# EAGLE design Imu shield v1 (EAGLE 6.1)
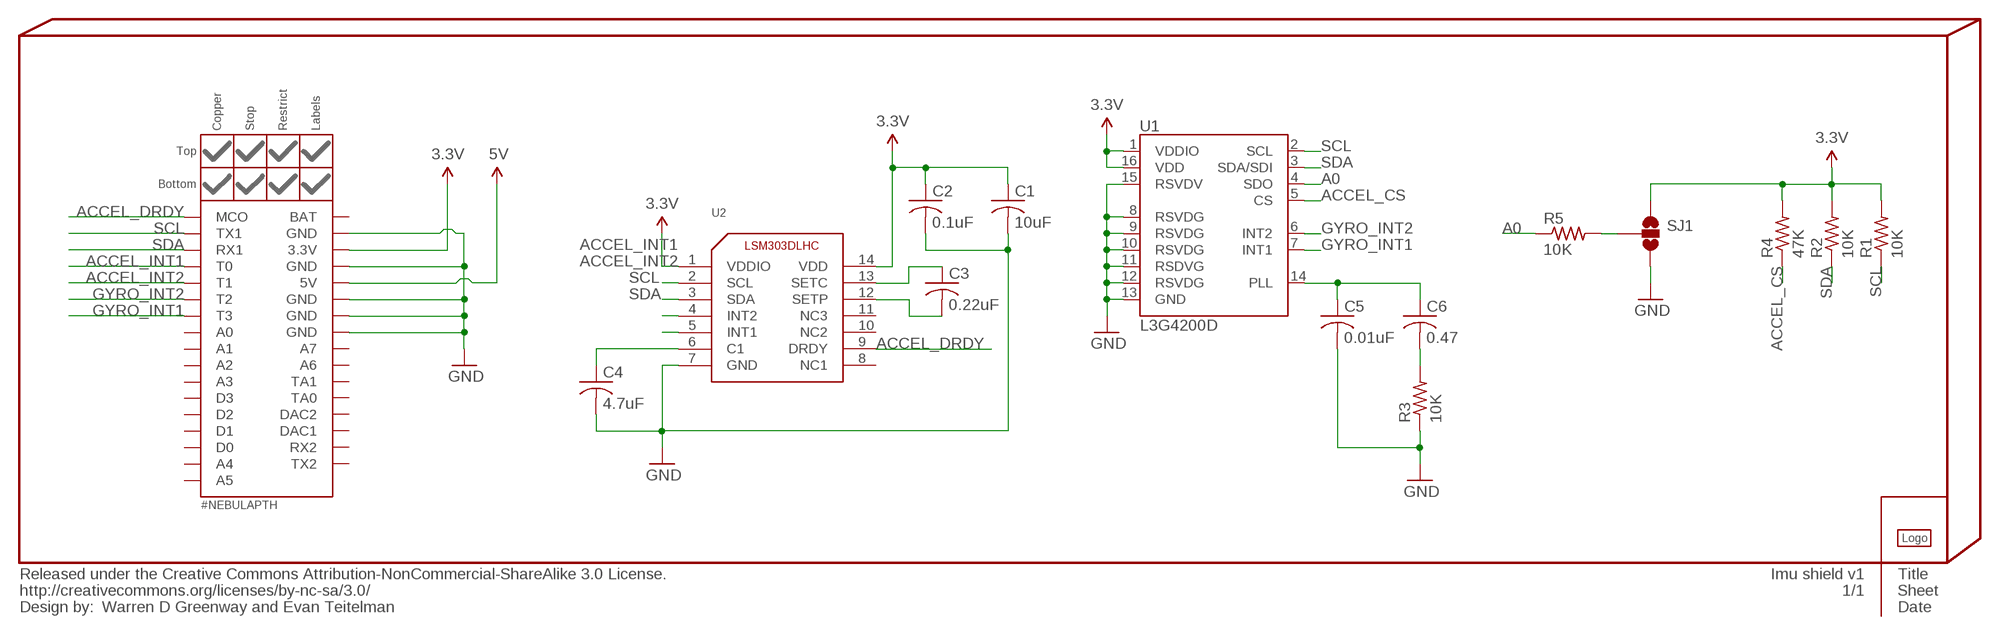
[diagram p0: schematic, sheet 1]

## Parts
C1  10uF  C-USC0805  [C0805]
C2  0.1uF  C-USC0402  [C0402]
C3  0.22uF  C-USC0402  [C0402]
C4  4.7uF  C-USC0402  [C0402]
C5  0.01uF  C-USC0402  [C0402]
C6  0.47  C-USC0402  [C0402]
INFO2  Warren D Greenway and Evan Teitelman  %CC-NC-SA  [%CC-NC-SA]
LOGO1  #PYGMYLOGONORMAL  #PYGMYLOGOLARGE  [#PYGMYLOGO]
NEBULA1  #NEBULAPTH  [#NEBULA-PTH]
NEBULAPART1  #NEBULA-PARTLABELS-TOP  [#NEBULA-LABELS-TOP]
R1  10K  R-US_R0402  [R0402]
R2  10K  R-US_R0402  [R0402]
R3  10K  R-US_R0402  [R0402]
R4  47K  R-US_R0402  [R0402]
R5  10K  R-US_R0402  [R0402]
SJ1  SOLDERJUMPER_2WAYPASTE1&2  [SJ_3_PASTE1&2]
U1  L3G4200D  [LGA16-4X4]
U2  FREESCALE-LSM303DLHC  [LGA14]

## Nets
3.3V: C1.1 C2.1 NEBULA1.3.3V R1.2 R2.2 R4.2 SJ1.1 U1.1(VDDIO) U1.16(VDD) U2.1(VDDIO) U2.14(VDD) ; supply symbol labelled @3.3V
5V: NEBULA1.5V ; supply symbol labelled @5V
A0: R5.1 U1.4(SDO)
ACCEL_CS: R4.1 U1.5(CS)
ACCEL_DRDY: NEBULA1.MCO U2.9(DRDY)
ACCEL_INT1: NEBULA1.T0 U2.4(INT2)
ACCEL_INT2: NEBULA1.T1 U2.5(INT1)
GND: C1.2 C2.2 C4.2 C5.2 NEBULA1.GND1(GND) NEBULA1.GND2(GND) NEBULA1.GND3(GND) NEBULA1.GND4(GND) NEBULA1.GND5(GND) R3.1 SJ1.3 U1.8(RSVDG) U1.9(RSVDG) U1.10(RSVDG) U1.11(RSDVG) U1.12(RSVDG) U1.13(GND) U1.15(RSVDV) U2.7(GND) ; supply symbol labelled @GND
GYRO_INT1: NEBULA1.T3 U1.7(INT1)
GYRO_INT2: NEBULA1.T2 U1.6(INT2)
N$1: C4.1 U2.6(C1)
N$2: C5.1 C6.1 U1.14(PLL)
N$3: C3.1 U2.13(SETC)
N$4: C3.2 U2.12(SETP)
N$5: R5.2 SJ1.2
N$8: C6.2 R3.2
SCL: NEBULA1.COM1_TX(TX1) R1.1 U1.2(SCL) U2.2(SCL)
SDA: NEBULA1.COM1_RX(RX1) R2.1 U1.3(SDA/SDI) U2.3(SDA)
Unconnected: NEBULA1.A0 NEBULA1.A1 NEBULA1.A2 NEBULA1.A3 NEBULA1.A4 NEBULA1.A5 NEBULA1.A6 NEBULA1.A7 NEBULA1.BAT NEBULA1.COM2_RX(RX2) NEBULA1.COM2_TX(TX2) NEBULA1.D0 NEBULA1.D1 NEBULA1.D2 NEBULA1.D3 NEBULA1.DAC1 NEBULA1.DAC2 NEBULA1.TA0 NEBULA1.TA1 U2.8(NC1) U2.10(NC2) U2.11(NC3)

## Library data of the parts
C1-C6 = rcl:C-US: CAPACITOR, American symbol
INFO2 = PygmyBoards:%CC-NC-SA: Released under the Creative Commons Attribution-NonCommercial-ShareAlike 3.0 License. http://creativecommons.org/licenses/by-sa/3.0 Design by: [Designer Name] Change this part's value to change the designer name
LOGO1 = Pygmy:#PYGMYLOGO
NEBULA1 = PygmyBoards:#NEBULA: Nebula Board and Shield Footprint Pads This is the only absolutely required part for the footprint. The parts in "#NEBULA-PART" are merely aesthetic. A circular board outline should be .001" thick and 1.005" in diameter (Reference circle on the Document (48) layer provided).
NEBULAPART1 = PygmyBoards:#NEBULA-PART: Nebula Board and Shield Footprint Parts These parts are only functional when combined with the pads in "#NEBULA".
R1-R5 = rcl:R-US_: RESISTOR, American symbol
SJ1 = Pygmy:SOLDERJUMPER_2WAY: Solder Jumper 2 way solder jumper
U1 = SparkFun:L3G4200D: L3G4200D Three-axis, digital output gyroscope The L3G4200D is a low-power three-axis angular rate sensor, has a full scale of ±250/±500/±2000 dps and is capable of measuring rates with a user-selectable bandwidth. It includes a sensing element and an IC interface capable of providing the measured angular rate to the external world through a digital interface (I2C/SPI). Package: 4x4x1.1 LGA-16 (LGA16-4x4.PAC)
U2 = Pygmy:FREESCALE-LSM303DLHC

## Board
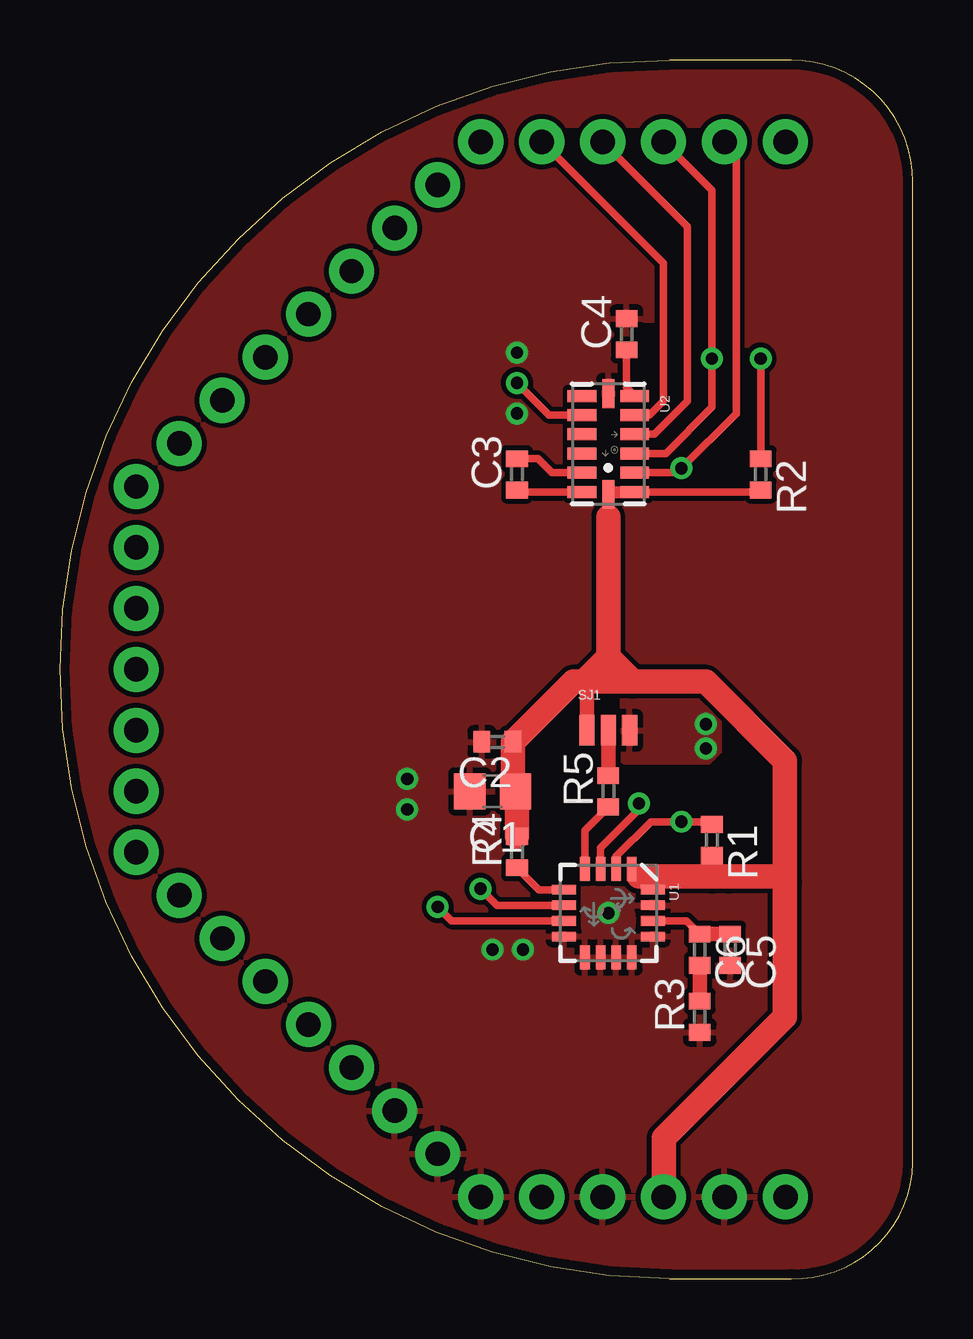
[diagram p1: board, top side]
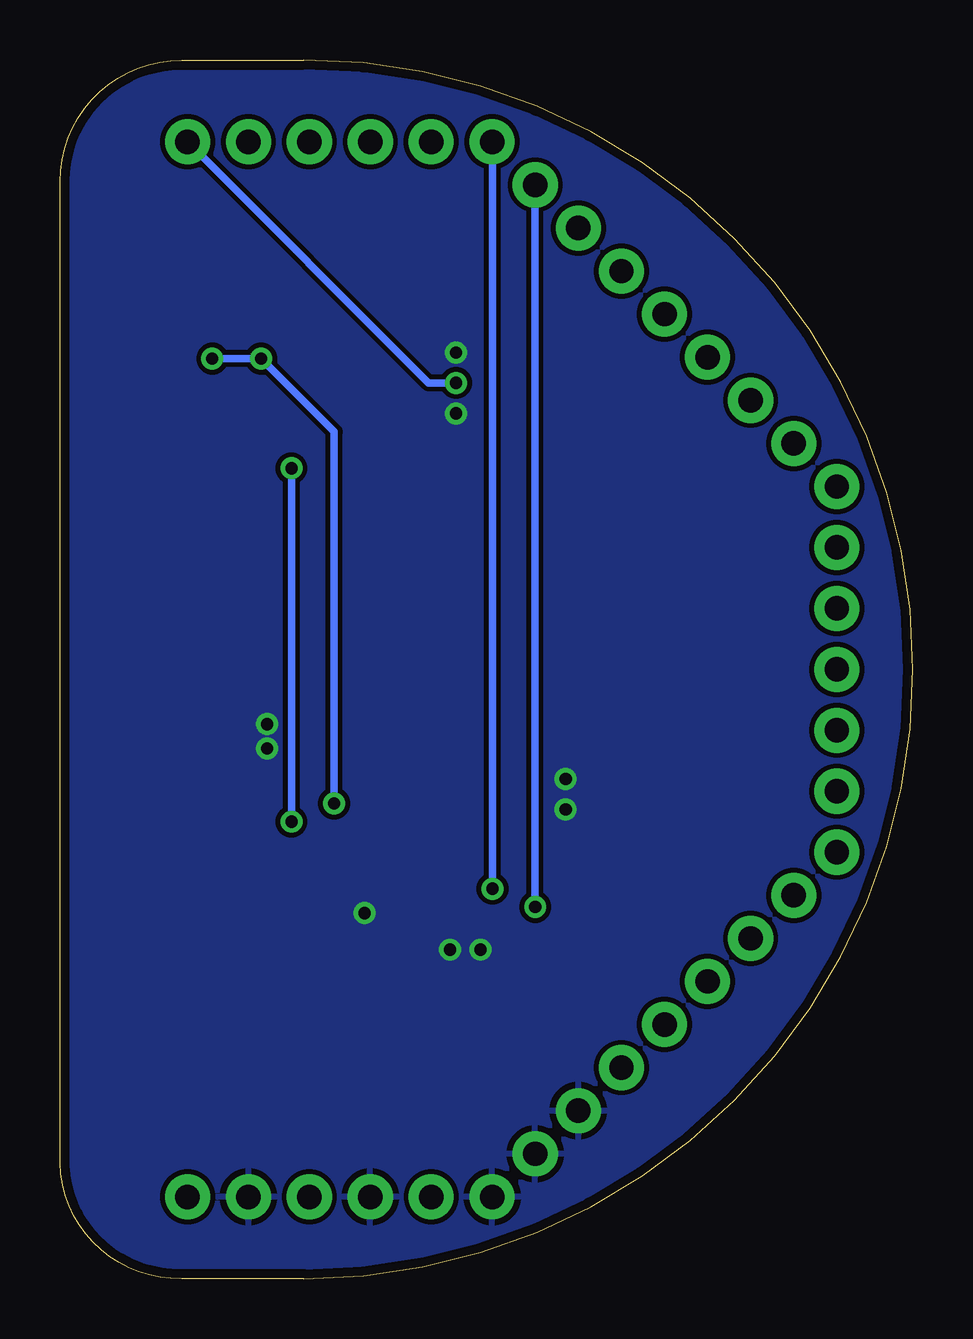
[diagram p2: board, bottom side, seen from below]

Size 35.56 x 50.8 mm. Coordinates in mm from the lower left corner, seen from the top.
Outline: 25.4,0 arc-180 25.4,50.8 30.48,50.8 arc-90 35.56,45.72 35.56,4.83 arc-90 30.48,0 25.4,0
Copper layers (1*16): Top 0.035mm / dielectric 1.5mm / Bottom 0.035mm
Design rules "PDX (Production)": minimum track width 6mil, minimum drill 15mil, track to track 6mil, track to pad 6mil, pad to pad 4mil, via to via 6mil, smd to smd 4mil, copper to edge 15mil, drill to drill 6mil, minimum pad ring 10mil, minimum via ring 8mil, stop-mask expansion 4mil, vias tented up to drill 25mil, thermal gap 10mil
tRestrict: 9 lines

### Footprints (pad centres in the part's own frame; a part is rotated, then mirrored left to right if it is on the bottom)
C0805 = smd 1.3 x 1.5: 1 -0.95,0; 2 0.95,0
C0402 = smd 0.7 x 0.9: 1 -0.65,0; 2 0.65,0
#NEBULA-PTH@1 = drill 1.016 pad 1.88 round: 3.3V -25.637,-47.388; 5V -30.716,-47.388; A0 -36.848,-7.004; A1 -38.645,-8.8; A2 -40.44,-10.596; A3 -42.237,-12.392; A4 -47.625,-22.86; A5 -47.625,-25.4; A6 -40.44,-40.204; A7 -38.645,-42; BAT -20.557,-47.388; COM1_RX -25.636,-3.412; COM1_TX -23.096,-3.412; COM2_RX -47.625,-30.48; COM2_TX -47.625,-27.94; D0 -47.625,-20.32; D1 -47.625,-17.78; D2 -45.829,-15.984; D3 -44.032,-14.188; DAC1 -47.625,-33.02; DAC2 -45.829,-34.816; GND1 -36.848,-43.796; GND2 -35.052,-45.592; GND3 -33.256,-47.388; GND4 -28.177,-47.388; GND5 -23.097,-47.388; MCO -20.556,-3.412; T0 -28.176,-3.412; T1 -30.716,-3.412; T2 -33.256,-3.412; T3 -35.052,-5.208; TA0 -44.032,-36.612; TA1 -42.237,-38.408
R0402 = smd 0.7 x 0.9: 1 -0.65,0; 2 0.65,0
SJ_3_PASTE1&2 = smd 0.635 x 1.27: 1 -0.889,0; 2 0,0; 3 0.889,0
LGA16-4X4 = smd 1 x 0.4: 1 -1.85,0.975; 2 -1.85,0.325; 3 -1.85,-0.325; 4 -1.85,-0.975; 9 1.85,-0.975; 10 1.85,-0.325; 11 1.85,0.325; 12 1.85,0.975 | smd 0.4 x 1: 5 -0.975,-1.85; 6 -0.325,-1.85; 7 0.325,-1.85; 8 0.975,-1.85; 13 0.975,1.85; 14 0.325,1.85; 15 -0.325,1.85; 16 -0.975,1.85
LGA14 = smd 0.5 x 1.2: 1 2,1.1; 2 1.2,1.1; 3 0.4,1.1; 4 -0.4,1.1; 5 -1.2,1.1; 6 -2,1.1; 8 -2,-1.1; 9 -1.2,-1.1; 10 -0.4,-1.1; 11 0.4,-1.1; 12 1.2,-1.1; 13 2,-1.1 | smd 1.2 x 0.5: 7 -2.1,0; 14 2.1,0

### Placement (x,y rotation side)
C1  18.03,20.32 180 top
C2  18.24,22.38 180 top
C3  19.05,33.53 90 top
C4  23.62,39.37 90 top
C5  27.94,13.72 270 top
C6  26.67,13.72 270 top
INFO2  -2.54,-10.16 0 top  (outside the outline)
LOGO1  27.94,9.91 90 bottom
NEBULA1  #NEBULAPTH  [#NEBULA-PTH@1]  50.8,50.8 0 top
NEBULAPART1  50.8,50.8 0 top  (outside the outline)
R1  27.18,18.29 270 top
R2  29.21,33.53 270 top
R3  26.67,10.92 90 top
R4  19.05,17.78 90 top
R5  22.86,20.32 90 top
SJ1  22.86,22.86 0 top
U1  22.86,15.24 270 top
U2  22.86,34.8 270 top

### Tracks (layer width: path | path; a pad name or v marks a point on that pad's centre or on a via)
3.3V
  Top 0.254: U1.1 27.36,17.09 27.94,16.51 27.96,16.51 28.22,16.76 27.89,16.76
  Top 0.305: U1.16 24.71,16.69 24.64,16.76 | 24.13,16.76 24.13,16.8 U1.1 | U2.1 29.13,32.8 R2.2
  Top 0.508: 22.86,31.75 U2.14 22.96,32.8 U2.1
  Top 0.61: SJ1.1 21.97,24.77 22.1,24.89 | 27.18,16.76 R1.2
  Top 1.016: 24.13,16.76 24.64,16.76 27.18,16.76 27.89,16.76 29.97,16.76 30.23,16.51 | R4.2 19.05,20.25 C1.1 18.89,20.42 C2.1 21.4,24.89 21.84,24.89 | 23.88,24.89 26.92,24.89 30.23,21.59 30.23,16.51 | 23.88,24.89 22.86,24.89 | 22.86,24.89 22.1,24.89 21.84,24.89 | 22.86,24.89 22.86,25.91 | 22.86,25.91 22.86,31.75 | 22.86,25.91 21.84,24.89 | 23.88,24.89 22.86,25.91 | 30.23,16.51 30.23,10.92 25.17,5.87 NEBULA1.3.3V
A0
  Top 0.305: U1.4 21.89,18.7 R5.1
ACCEL_CS
  Top 0.305: U1.5 19.96,16.21 R4.1
ACCEL_DRDY  (via drill 0.51)
  Top 0.305: U2.9 20.39,36 v19.05,37.34
  Bottom 0.305: NEBULA1.MCO 20.19,37.34 v19.05,37.34
ACCEL_INT1
  Top 0.305: U2.4 24.78,35.2 26.16,36.58 26.16,43.85 NEBULA1.T0
ACCEL_INT2
  Top 0.305: U2.5 24.57,36 25.15,36.58 25.15,42.33 NEBULA1.T1
GND  (via drill 0.51)
  other vias: 26.92,22.1 22.86,15.24 19.3,13.72 18.03,13.72 14.48,20.83 19.05,38.61 19.05,36.07 14.48,19.56 26.92,23.11
  pour Bottom (isolate 0.203): -2.54,-2.54 38.1,-2.54 38.1,53.34 -2.54,53.34
  pour Top (isolate 0.203): -1.27,-1.27 36.83,-1.27 36.83,52.07 -1.27,52.07
GYRO_INT1  (via drill 0.51)
  Top 0.305: U1.7 16.33,14.91 v15.75,15.49
  Bottom 0.305: v15.75,15.49 NEBULA1.T3 | NEBULA1.T3
GYRO_INT2  (via drill 0.51)
  Top 0.305: U1.6 18.22,15.57 v17.53,16.26
  Bottom 0.305: v17.53,16.26 17.53,47.37 NEBULA1.T2
N$1
  Top 0.305: C4.1 23.62,37.14 U2.6
N$2
  Top 0.305: U1.14 26.12,14.91 C6.1
  Top 0.61: C6.1 C5.1
N$3
  Top 0.305: U2.13 19.13,32.8 C3.1
N$4
  Top 0.305: U2.12 20.5,33.6 19.92,34.18 C3.2
N$5
  Top 0.61: R5.2 SJ1.2
N$8
  Top 0.61: R3.2 C6.2
SCL  (via drill 0.51)
  Top 0.305: U1.2 23.19,17.6 24.64,19.05 v25.91,19.05 27.07,19.05 R1.1 | U2.2 25.72,33.6 v25.91,33.78 28.19,36.07 28.19,46.9 NEBULA1.COM1_TX
  Bottom 0.305: v25.91,19.05 v25.91,33.78
SDA  (via drill 0.51)
  Top 0.305: U2.3 25.25,34.4 27.18,36.32 v27.18,38.35 27.18,45.37 NEBULA1.COM1_RX | v29.21,38.35 R2.1 | U1.3 22.54,17.96 24.13,19.56 v24.13,19.81
  Bottom 0.305: v29.21,38.35 v27.18,38.35 24.13,35.31 v24.13,19.81

### Text on the board
bTest: Pygmy Motion Shield v1 | Warren D Greenway | Evan Teitelman | Designed By:
Document: Pygmy IMU Shield v1 | Standard Grid: 50mil